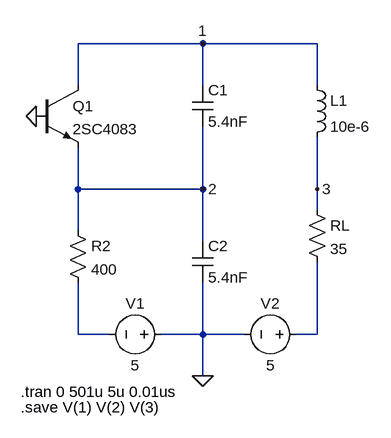
[diagram p0: schematic C_TX.asc]
C_TX.asc, the LTspice schematic file:
Version 4
SHEET 1 996 708
WIRE 64 0 -128 0
WIRE 240 0 64 0
WIRE -128 64 -128 0
WIRE 64 64 64 0
WIRE 240 64 240 0
WIRE -128 224 -128 160
WIRE 64 224 64 128
WIRE 64 224 -128 224
WIRE 240 224 240 144
WIRE 240 256 240 224
WIRE -128 288 -128 224
WIRE 64 304 64 224
WIRE -128 448 -128 368
WIRE -80 448 -128 448
WIRE 64 448 64 368
WIRE 64 448 0 448
WIRE 128 448 64 448
WIRE 240 448 240 336
WIRE 240 448 208 448
WIRE 64 512 64 448
FLAG -192 112 0
FLAG 64 512 0
FLAG 64 0 1
FLAG 64 224 2
FLAG 240 224 3
SYMBOL ind 224 48 R0
SYMATTR InstName L1
SYMATTR Value 10e-6
SYMBOL cap 48 64 R0
SYMATTR InstName C1
SYMATTR Value 5.4nF
SYMBOL cap 48 304 R0
SYMATTR InstName C2
SYMATTR Value 5.4nF
SYMBOL res 224 240 R0
SYMATTR InstName RL
SYMATTR Value 35
SYMBOL res -144 272 R0
SYMATTR InstName R2
SYMATTR Value 400
SYMBOL voltage 16 448 R90
WINDOW 0 -32 56 VBottom 2
WINDOW 3 32 56 VTop 2
WINDOW 123 0 0 Left 0
WINDOW 39 0 0 Left 0
SYMATTR InstName V1
SYMATTR Value 5
SYMBOL voltage 224 448 R90
WINDOW 0 -32 56 VBottom 2
WINDOW 3 32 56 VTop 2
WINDOW 123 0 0 Left 0
WINDOW 39 0 0 Left 0
SYMATTR InstName V2
SYMATTR Value 5
SYMBOL npn -192 64 R0
SYMATTR InstName Q1
SYMATTR Value 2SC4083
TEXT -216 536 Left 2 !.tran 0 501u 5u 0.01us
TEXT -216 560 Left 2 !.save V(1) V(2) V(3)

The netlist it stands for:
* C_TX.asc
L1 1 3 10e-6
C1 1 2 5.4nF
C2 2 0 5.4nF
RL 3 N002 35
R2 2 N001 400
V1 0 N001 5
V2 N002 0 5
Q1 1 0 2 0 2SC4083
.model NPN NPN
.model PNP PNP
.lib standard.bjt
.tran 0 501u 5u 0.01us
.save V(1) V(2) V(3)
.backanno
.end